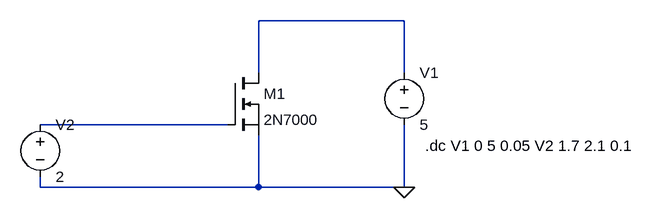
[diagram p0: schematic NMOS1.asc]
NMOS1.asc, the LTspice schematic file:
Version 4
SHEET 1 880 680
WIRE -64 16 -288 16
WIRE -288 96 -288 16
WIRE -64 96 -64 16
WIRE -336 176 -624 176
WIRE -624 272 -624 256
WIRE -288 272 -288 192
WIRE -288 272 -624 272
WIRE -64 272 -64 176
WIRE -64 272 -288 272
FLAG -64 272 0
SYMBOL nmos -336 96 R0
SYMATTR InstName M1
SYMATTR Value 2N7000
SYMBOL voltage -64 80 R0
WINDOW 123 0 0 Left 0
WINDOW 39 0 0 Left 0
SYMATTR InstName V1
SYMATTR Value 5
SYMBOL voltage -624 160 R0
WINDOW 123 0 0 Left 0
WINDOW 39 0 0 Left 0
SYMATTR InstName V2
SYMATTR Value 2
TEXT -32 208 Left 2 !.dc V1 0 5 0.05 V2 1.7 2.1 0.1

The netlist it stands for:
* NMOS1.asc
M1 N001 N002 0 0 2N7000
V1 N001 0 5
V2 N002 0 2
.model NMOS NMOS
.model PMOS PMOS
.lib standard.mos
.dc V1 0 5 0.05 V2 1.7 2.1 0.1
.backanno
.end